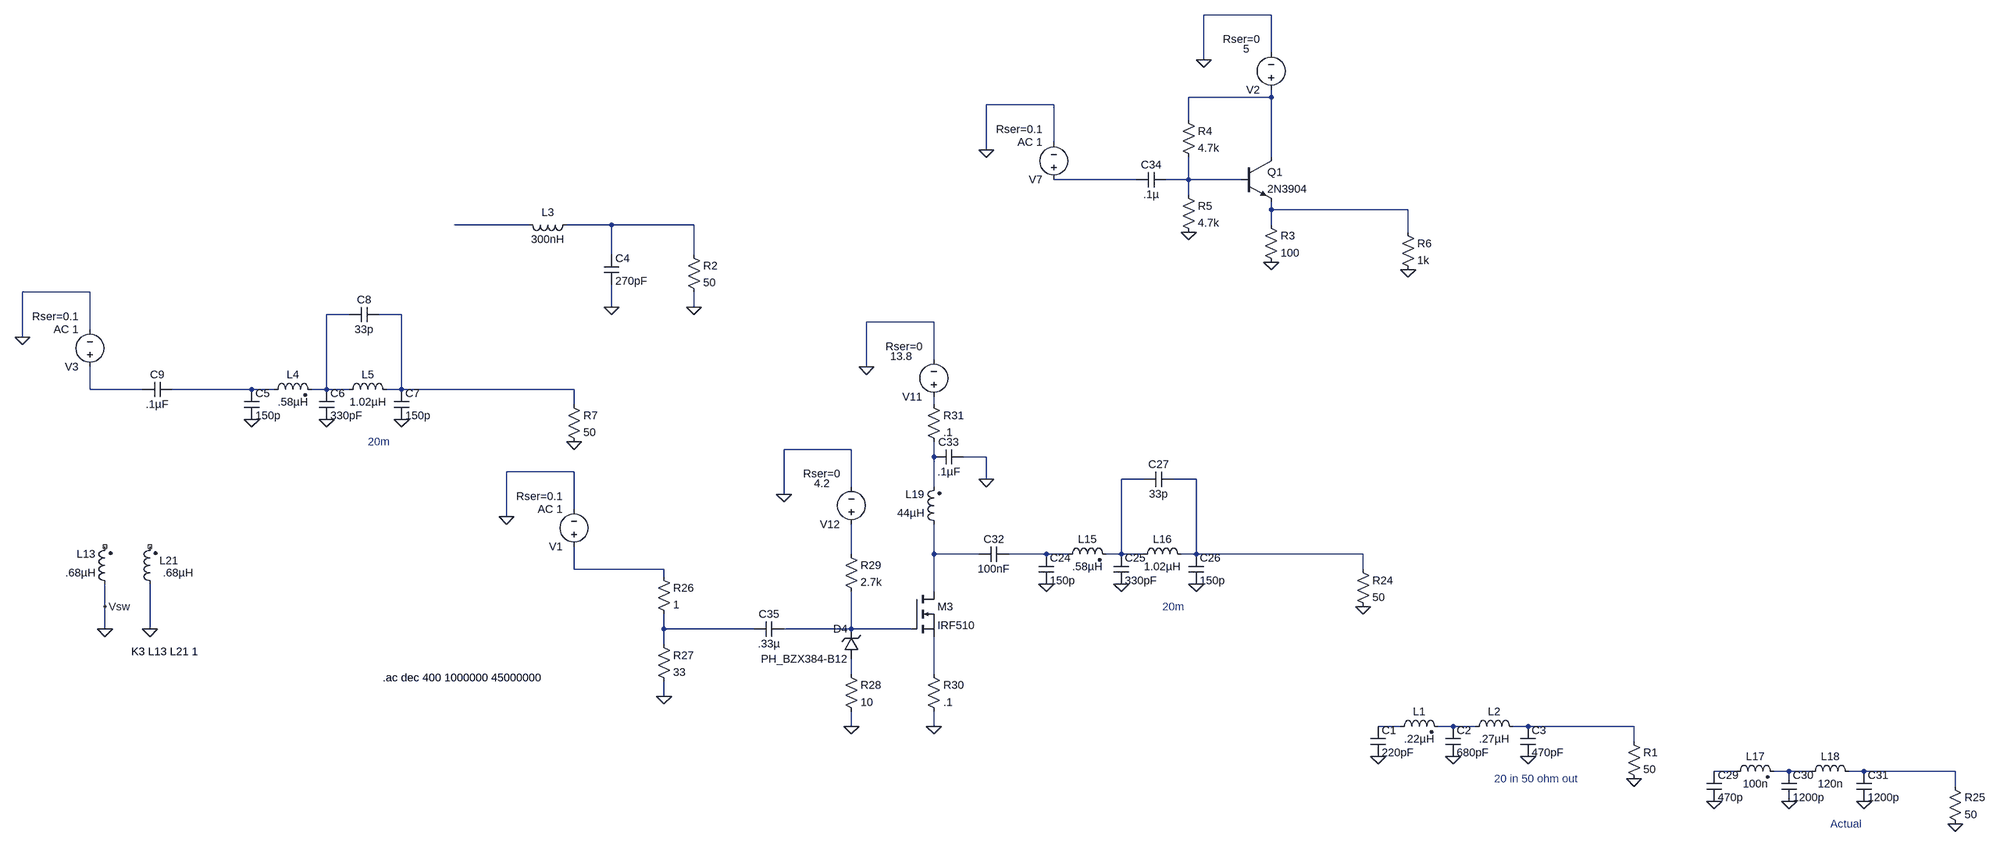
[diagram p0: schematic 10W IRF510 Amp - Impedance.asc]
10W IRF510 Amp - Impedance.asc, the LTspice schematic file:
Version 4
SHEET 1 3764 1240
WIRE 1136 -4208 992 -4208
WIRE 1136 -4128 1136 -4208
WIRE 992 -4112 992 -4208
WIRE 1136 -4032 1136 -4048
WIRE 1136 -4032 960 -4032
WIRE 672 -4016 528 -4016
WIRE 960 -3984 960 -4032
WIRE 672 -3936 672 -4016
WIRE 528 -3920 528 -4016
WIRE 1136 -3904 1136 -4032
WIRE 848 -3856 672 -3856
WIRE 960 -3856 960 -3904
WIRE 960 -3856 912 -3856
WIRE 1072 -3856 960 -3856
WIRE 960 -3824 960 -3856
WIRE 1136 -3792 1136 -3808
WIRE 1440 -3792 1136 -3792
WIRE -448 -3760 -608 -3760
WIRE -272 -3760 -368 -3760
WIRE -96 -3760 -272 -3760
WIRE 1136 -3760 1136 -3792
WIRE 1440 -3744 1440 -3792
WIRE -272 -3696 -272 -3760
WIRE -96 -3696 -96 -3760
WIRE -1392 -3616 -1536 -3616
WIRE -272 -3584 -272 -3632
WIRE -96 -3584 -96 -3616
WIRE -832 -3568 -880 -3568
WIRE -720 -3568 -768 -3568
WIRE 416 -3552 272 -3552
WIRE -1392 -3536 -1392 -3616
WIRE -1536 -3520 -1536 -3616
WIRE 416 -3472 416 -3552
WIRE 272 -3456 272 -3552
WIRE -1392 -3408 -1392 -3456
WIRE -1280 -3408 -1392 -3408
WIRE -1040 -3408 -1216 -3408
WIRE -992 -3408 -1040 -3408
WIRE -880 -3408 -880 -3568
WIRE -880 -3408 -912 -3408
WIRE -832 -3408 -880 -3408
WIRE -720 -3408 -720 -3568
WIRE -720 -3408 -752 -3408
WIRE -352 -3408 -720 -3408
WIRE -352 -3376 -352 -3408
WIRE 416 -3376 416 -3392
WIRE 240 -3280 96 -3280
WIRE 416 -3264 416 -3296
WIRE 528 -3264 480 -3264
WIRE -352 -3232 -496 -3232
WIRE 528 -3216 528 -3264
WIRE 864 -3216 816 -3216
WIRE 976 -3216 928 -3216
WIRE 240 -3200 240 -3280
WIRE 416 -3200 416 -3264
WIRE 96 -3184 96 -3280
WIRE -352 -3152 -352 -3232
WIRE -496 -3136 -496 -3232
WIRE 240 -3056 240 -3120
WIRE 416 -3056 416 -3120
WIRE 512 -3056 416 -3056
WIRE 656 -3056 576 -3056
WIRE 704 -3056 656 -3056
WIRE 816 -3056 816 -3216
WIRE 816 -3056 784 -3056
WIRE 864 -3056 816 -3056
WIRE 976 -3056 976 -3216
WIRE 976 -3056 944 -3056
WIRE 1344 -3056 976 -3056
WIRE -352 -3024 -352 -3072
WIRE -160 -3024 -352 -3024
WIRE 1344 -3024 1344 -3056
WIRE -160 -3008 -160 -3024
WIRE 416 -2976 416 -3056
WIRE -1360 -2944 -1360 -2992
WIRE -1360 -2896 -1360 -2944
WIRE -1264 -2896 -1264 -2992
WIRE -160 -2896 -160 -2928
WIRE 32 -2896 -160 -2896
WIRE 240 -2896 240 -2976
WIRE 240 -2896 96 -2896
WIRE 368 -2896 240 -2896
WIRE -160 -2864 -160 -2896
WIRE 240 -2800 240 -2832
WIRE 416 -2800 416 -2880
WIRE -160 -2752 -160 -2784
WIRE 240 -2688 240 -2720
WIRE 416 -2688 416 -2720
WIRE 1424 -2688 1376 -2688
WIRE 1536 -2688 1504 -2688
WIRE 1584 -2688 1536 -2688
WIRE 1696 -2688 1664 -2688
WIRE 2064 -2688 1696 -2688
WIRE 2064 -2656 2064 -2688
WIRE 2528 -2592 2480 -2592
WIRE 2640 -2592 2608 -2592
WIRE 2688 -2592 2640 -2592
WIRE 2800 -2592 2768 -2592
WIRE 3168 -2592 2800 -2592
WIRE 3168 -2560 3168 -2592
FLAG 528 -3920 0
FLAG -1360 -2944 Vsw
FLAG 1344 -2944 0
FLAG 656 -2992 0
FLAG 816 -2992 0
FLAG 976 -2992 0
FLAG 3168 -2480 0
FLAG 2480 -2528 0
FLAG 2640 -2528 0
FLAG 2800 -2528 0
FLAG 272 -3456 0
FLAG 528 -3216 0
FLAG -1264 -2896 0
FLAG -160 -2752 0
FLAG 240 -2688 0
FLAG 416 -2688 0
FLAG 96 -3184 0
FLAG -1360 -2896 0
FLAG 2064 -2576 0
FLAG 1376 -2624 0
FLAG 1536 -2624 0
FLAG 1696 -2624 0
FLAG -496 -3136 0
FLAG -272 -3584 0
FLAG -96 -3584 0
FLAG 1136 -3680 0
FLAG 992 -4112 0
FLAG 960 -3744 0
FLAG 1440 -3664 0
FLAG -352 -3296 0
FLAG -1040 -3344 0
FLAG -880 -3344 0
FLAG -720 -3344 0
FLAG -1536 -3520 0
SYMBOL voltage 672 -3840 R180
WINDOW 123 24 96 Left 2
WINDOW 39 24 124 Left 2
WINDOW 3 46 103 Left 2
SYMATTR Value2 AC 1
SYMATTR SpiceLine Rser=0.1
SYMATTR Value ""
SYMATTR InstName V7
SYMBOL ind2 -1344 -2976 R180
WINDOW 0 36 80 Left 2
WINDOW 3 36 40 Left 2
SYMATTR InstName L13
SYMATTR Value .68µH
SYMATTR Type ind
SYMBOL res 1328 -3040 R0
SYMATTR InstName R24
SYMATTR Value 50
SYMBOL cap 640 -3056 R0
SYMATTR InstName C24
SYMATTR Value 150p
SYMBOL cap 800 -3056 R0
SYMATTR InstName C25
SYMATTR Value 330pF
SYMBOL cap 960 -3056 R0
SYMATTR InstName C26
SYMATTR Value 150p
SYMBOL ind2 688 -3040 R270
WINDOW 0 32 56 VTop 2
WINDOW 3 5 56 VBottom 2
SYMATTR InstName L15
SYMATTR Value .58µH
SYMATTR Type ind
SYMBOL ind 848 -3040 R270
WINDOW 0 32 56 VTop 2
WINDOW 3 5 56 VBottom 2
SYMATTR InstName L16
SYMATTR Value 1.02µH
SYMBOL cap 928 -3232 R90
WINDOW 0 0 32 VBottom 2
WINDOW 3 32 32 VTop 2
SYMATTR InstName C27
SYMATTR Value 33p
SYMBOL res 3152 -2576 R0
SYMATTR InstName R25
SYMATTR Value 50
SYMBOL cap 2464 -2592 R0
SYMATTR InstName C29
SYMATTR Value 470p
SYMBOL cap 2624 -2592 R0
SYMATTR InstName C30
SYMATTR Value 1200p
SYMBOL cap 2784 -2592 R0
SYMATTR InstName C31
SYMATTR Value 1200p
SYMBOL ind2 2512 -2576 R270
WINDOW 0 32 56 VTop 2
WINDOW 3 5 56 VBottom 2
SYMATTR InstName L17
SYMATTR Value 100n
SYMATTR Type ind
SYMBOL ind 2672 -2576 R270
WINDOW 0 32 56 VTop 2
WINDOW 3 5 56 VBottom 2
SYMATTR InstName L18
SYMATTR Value 120n
SYMBOL voltage 416 -3376 R180
WINDOW 123 0 0 Left 0
WINDOW 39 24 124 Left 2
WINDOW 3 46 103 Left 2
SYMATTR SpiceLine Rser=0
SYMATTR Value 13.8
SYMATTR InstName V11
SYMBOL ind2 432 -3104 R180
WINDOW 0 36 80 Left 2
WINDOW 3 36 40 Left 2
SYMATTR InstName L19
SYMATTR Value 44µH
SYMATTR Type ind
SYMBOL cap 576 -3072 R90
WINDOW 0 0 32 VBottom 2
WINDOW 3 32 32 VTop 2
SYMATTR InstName C32
SYMATTR Value 100nF
SYMBOL ind2 -1248 -2976 R180
WINDOW 0 -45 66 Left 2
WINDOW 3 -76 40 Left 2
SYMATTR InstName L21
SYMATTR Value .68µH
SYMATTR Type ind
SYMBOL cap 480 -3280 R90
WINDOW 0 0 32 VBottom 2
WINDOW 3 32 32 VTop 2
SYMATTR InstName C33
SYMATTR Value .1µF
SYMBOL cap 912 -3872 R90
WINDOW 0 0 32 VBottom 2
WINDOW 3 32 32 VTop 2
SYMATTR InstName C34
SYMATTR Value .1µ
SYMBOL zener 256 -2832 R180
WINDOW 0 24 64 Left 2
WINDOW 3 24 0 Left 2
SYMATTR InstName D4
SYMATTR Value PH_BZX384-B12
SYMBOL res -176 -3024 R0
SYMATTR InstName R26
SYMATTR Value 1
SYMBOL res -176 -2880 R0
SYMATTR InstName R27
SYMATTR Value 33
SYMBOL cap 96 -2912 R90
WINDOW 0 0 32 VBottom 2
WINDOW 3 32 32 VTop 2
SYMATTR InstName C35
SYMATTR Value .33µ
SYMBOL res 224 -2816 R0
SYMATTR InstName R28
SYMATTR Value 10
SYMBOL nmos 368 -2976 R0
SYMATTR InstName M3
SYMATTR Value IRF510
SYMBOL res 224 -3072 R0
SYMATTR InstName R29
SYMATTR Value 2.7k
SYMBOL voltage 240 -3104 R180
WINDOW 123 0 0 Left 0
WINDOW 39 24 124 Left 2
WINDOW 3 46 103 Left 2
SYMATTR SpiceLine Rser=0
SYMATTR Value 4.2
SYMATTR InstName V12
SYMBOL res 400 -2816 R0
SYMATTR InstName R30
SYMATTR Value .1
SYMBOL res 400 -3392 R0
SYMATTR InstName R31
SYMATTR Value .1
SYMBOL res 2048 -2672 R0
SYMATTR InstName R1
SYMATTR Value 50
SYMBOL cap 1360 -2688 R0
SYMATTR InstName C1
SYMATTR Value 220pF
SYMBOL cap 1520 -2688 R0
SYMATTR InstName C2
SYMATTR Value 680pF
SYMBOL cap 1680 -2688 R0
SYMATTR InstName C3
SYMATTR Value 470pF
SYMBOL ind2 1408 -2672 R270
WINDOW 0 32 56 VTop 2
WINDOW 3 5 56 VBottom 2
SYMATTR InstName L1
SYMATTR Value .22µH
SYMATTR Type ind
SYMBOL ind 1568 -2672 R270
WINDOW 0 32 56 VTop 2
WINDOW 3 5 56 VBottom 2
SYMATTR InstName L2
SYMATTR Value .27µH
SYMBOL voltage -352 -3056 R180
WINDOW 123 24 96 Left 2
WINDOW 39 24 124 Left 2
WINDOW 3 46 103 Left 2
SYMATTR Value2 AC 1
SYMATTR SpiceLine Rser=0.1
SYMATTR Value ""
SYMATTR InstName V1
SYMBOL ind -352 -3776 R90
WINDOW 0 5 56 VBottom 2
WINDOW 3 32 56 VTop 2
SYMATTR InstName L3
SYMATTR Value 300nH
SYMBOL cap -288 -3696 R0
SYMATTR InstName C4
SYMATTR Value 270pF
SYMBOL res -112 -3712 R0
SYMATTR InstName R2
SYMATTR Value 50
SYMBOL npn 1072 -3904 R0
SYMATTR InstName Q1
SYMATTR Value 2N3904
SYMBOL res 1120 -3776 R0
SYMATTR InstName R3
SYMATTR Value 100
SYMBOL voltage 1136 -4032 R180
WINDOW 123 0 0 Left 0
WINDOW 39 24 124 Left 2
WINDOW 3 46 103 Left 2
SYMATTR SpiceLine Rser=0
SYMATTR Value 5
SYMATTR InstName V2
SYMBOL res 944 -4000 R0
SYMATTR InstName R4
SYMATTR Value 4.7k
SYMBOL res 944 -3840 R0
SYMATTR InstName R5
SYMATTR Value 4.7k
SYMBOL res 1424 -3760 R0
SYMATTR InstName R6
SYMATTR Value 1k
SYMBOL res -368 -3392 R0
SYMATTR InstName R7
SYMATTR Value 50
SYMBOL cap -1056 -3408 R0
SYMATTR InstName C5
SYMATTR Value 150p
SYMBOL cap -896 -3408 R0
SYMATTR InstName C6
SYMATTR Value 330pF
SYMBOL cap -736 -3408 R0
SYMATTR InstName C7
SYMATTR Value 150p
SYMBOL ind2 -1008 -3392 R270
WINDOW 0 32 56 VTop 2
WINDOW 3 5 56 VBottom 2
SYMATTR InstName L4
SYMATTR Value .58µH
SYMATTR Type ind
SYMBOL ind -848 -3392 R270
WINDOW 0 32 56 VTop 2
WINDOW 3 5 56 VBottom 2
SYMATTR InstName L5
SYMATTR Value 1.02µH
SYMBOL cap -768 -3584 R90
WINDOW 0 0 32 VBottom 2
WINDOW 3 32 32 VTop 2
SYMATTR InstName C8
SYMATTR Value 33p
SYMBOL voltage -1392 -3440 R180
WINDOW 123 24 96 Left 2
WINDOW 39 24 124 Left 2
WINDOW 3 46 103 Left 2
SYMATTR Value2 AC 1
SYMATTR SpiceLine Rser=0.1
SYMATTR Value ""
SYMATTR InstName V3
SYMBOL cap -1216 -3424 R90
WINDOW 0 0 32 VBottom 2
WINDOW 3 32 32 VTop 2
SYMATTR InstName C9
SYMATTR Value .1µF
TEXT 904 -2944 Left 2 ;20m
TEXT 2728 -2480 Left 2 ;Actual
TEXT -1304 -2848 Left 2 !K3 L13 L21 1
TEXT -760 -2792 Left 2 !.ac dec 400 1000000 45000000
TEXT 1624 -2576 Left 2 ;20 in 50 ohm out
TEXT -792 -3296 Left 2 ;20m

The netlist it stands for:
* 10W IRF510 Amp - Impedance.asc
V7 N002 0 AC 1 Rser=0.1
L13 0 NC_01 .68µH
R24 N014 0 50
C24 N017 0 150p
C25 N013 0 330pF
C26 N014 0 150p
L15 N017 N013 .58µH
L16 N013 N014 1.02µH
C27 N014 N013 33p
R25 N028 0 50
C29 N026 0 470p
C30 N027 0 1200p
C31 N028 0 1200p
L17 N026 N027 100n
L18 N027 N028 120n
V11 N011 0 13.8 Rser=0
L19 N016 N012 44µH
C32 N017 N016 100nF
L21 0 NC_02 .68µH
C33 0 N012 .1µF
C34 N003 N002 .1µ
D4 N021 N020 PH_BZX384-B12
R26 N018 N019 1
R27 N019 0 33
C35 N020 N019 .33µ
R28 N021 0 10
M3 N016 N020 N022 N022 IRF510
R29 N015 N020 2.7k
V12 N015 0 4.2 Rser=0
R30 N022 0 .1
R31 N011 N012 .1
R1 N025 0 50
C1 N023 0 220pF
C2 N024 0 680pF
C3 N025 0 470pF
L1 N023 N024 .22µH
L2 N024 N025 .27µH
V1 N018 0 AC 1 Rser=0.1
L3 N006 N005 300nH
C4 N006 0 270pF
R2 N006 0 50
Q1 N001 N003 N004 0 2N3904
R3 N004 0 100
V2 N001 0 5 Rser=0
R4 N001 N003 4.7k
R5 N003 0 4.7k
R6 N004 0 1k
R7 N008 0 50
C5 N010 0 150p
C6 N007 0 330pF
C7 N008 0 150p
L4 N010 N007 .58µH
L5 N007 N008 1.02µH
C8 N008 N007 33p
V3 N009 0 AC 1 Rser=0.1
C9 N010 N009 .1µF
.model D D
.lib standard.dio
.model NPN NPN
.model PNP PNP
.lib standard.bjt
.model NMOS NMOS
.model PMOS PMOS
.lib standard.mos
* 20m
* Actual
K3 L13 L21 1
.ac dec 400 1000000 45000000
* 20 in 50 ohm out
* 20m
.backanno
.end